# EAGLE design ArduinoPiano (EAGLE 7.3.0)
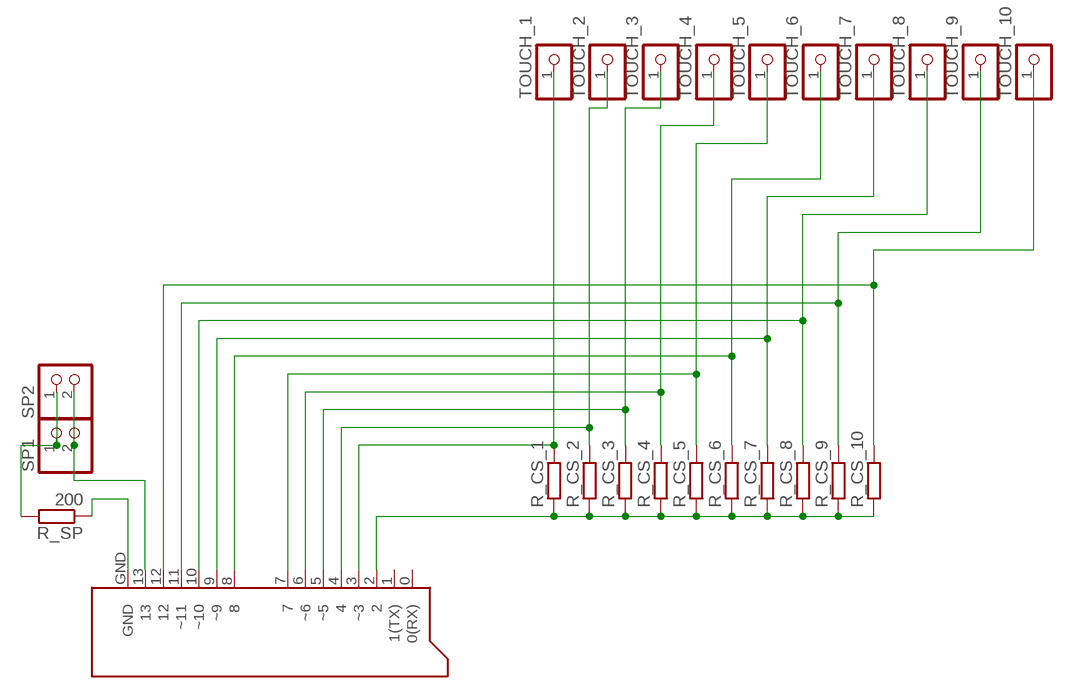
[diagram p0: schematic, sheet 1]

## Parts
PCB1  ARDUINO_UNO  [ARDUINO_UNO]
R_CS_1  R-EU_0204/7  [0204/7]
R_CS_2  R-EU_0204/7  [0204/7]
R_CS_3  R-EU_0204/7  [0204/7]
R_CS_4  R-EU_0204/7  [0204/7]
R_CS_5  R-EU_0204/7  [0204/7]
R_CS_6  R-EU_0204/7  [0204/7]
R_CS_7  R-EU_0204/7  [0204/7]
R_CS_8  R-EU_0204/7  [0204/7]
R_CS_9  R-EU_0204/7  [0204/7]
R_CS_10  R-EU_0204/7  [0204/7]
R_SP  200  R-EU_0204/7  [0204/7]
SP1  PINHD-1X2  [1X02]
SP2  PINHD-1X2  [1X02]
TOUCH_1  PINHD-1X1  [1X01]
TOUCH_2  PINHD-1X1  [1X01]
TOUCH_3  PINHD-1X1  [1X01]
TOUCH_4  PINHD-1X1  [1X01]
TOUCH_5  PINHD-1X1  [1X01]
TOUCH_6  PINHD-1X1  [1X01]
TOUCH_7  PINHD-1X1  [1X01]
TOUCH_8  PINHD-1X1  [1X01]
TOUCH_9  PINHD-1X1  [1X01]
TOUCH_10  PINHD-1X1  [1X01]

## Nets
+SPEAKER: PCB1.13 SP1.2 SP2.2
CS_REC_1: PCB1.3(~3) R_CS_1.2 TOUCH_1.1
CS_REC_2: PCB1.4 R_CS_2.2 TOUCH_2.1
CS_REC_3: PCB1.5(~5) R_CS_3.2 TOUCH_3.1
CS_REC_4: PCB1.6(~6) R_CS_4.2 TOUCH_4.1
CS_REC_5: PCB1.7 R_CS_5.2 TOUCH_5.1
CS_REC_6: PCB1.8 R_CS_6.2 TOUCH_6.1
CS_REC_7: PCB1.9(~9) R_CS_7.2 TOUCH_7.1
CS_REC_8: PCB1.10(~10) R_CS_8.2 TOUCH_8.1
CS_REC_9: PCB1.11(~11) R_CS_9.2 TOUCH_9.1
CS_REC_10: PCB1.12 R_CS_10.2 TOUCH_10.1
CS_SEND: PCB1.2 R_CS_1.1 R_CS_2.1 R_CS_3.1 R_CS_4.1 R_CS_5.1 R_CS_6.1 R_CS_7.1 R_CS_8.1 R_CS_9.1 R_CS_10.1
GND_SPEAKER: PCB1.GND R_SP.1
N$1: R_SP.2 SP1.1 SP2.1
Unconnected: PCB1.0(0(RX)) PCB1.1(1(TX))

## Library data of the parts
PCB1 = PianoArduino:ARDUINO_UNO: Device for representing an Arduino Uno board with a footprint in an EAGLE design. Created by Dave Young for Element14. More EAGLE documentation at: http://www.element14.com/community/community/knode/cadsoft_eagle
R_CS_1-R_CS_10 R_SP = resistor:R-EU_: RESISTOR, European symbol
SP1 SP2 = pinhead:PINHD-1X2: PIN HEADER
TOUCH_1-TOUCH_10 = pinhead:PINHD-1X1: PIN HEADER

## Board
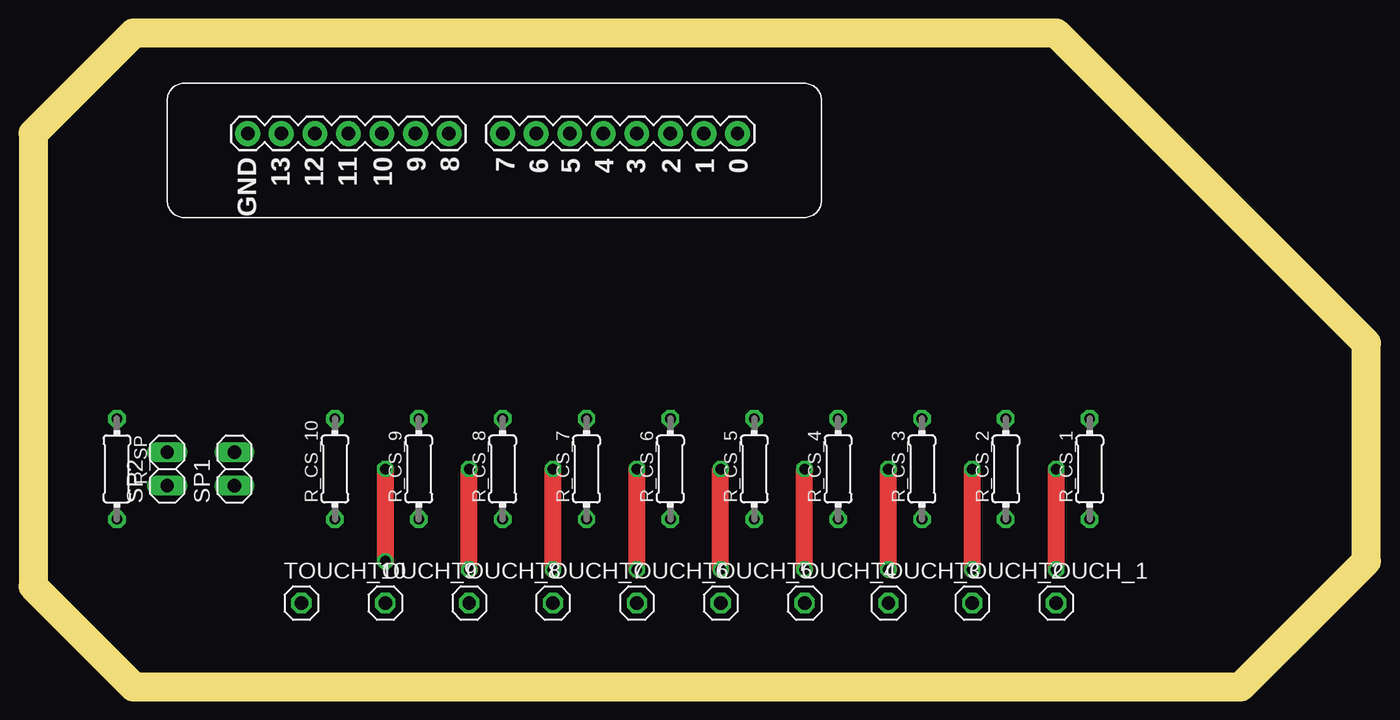
[diagram p1: board, top side]
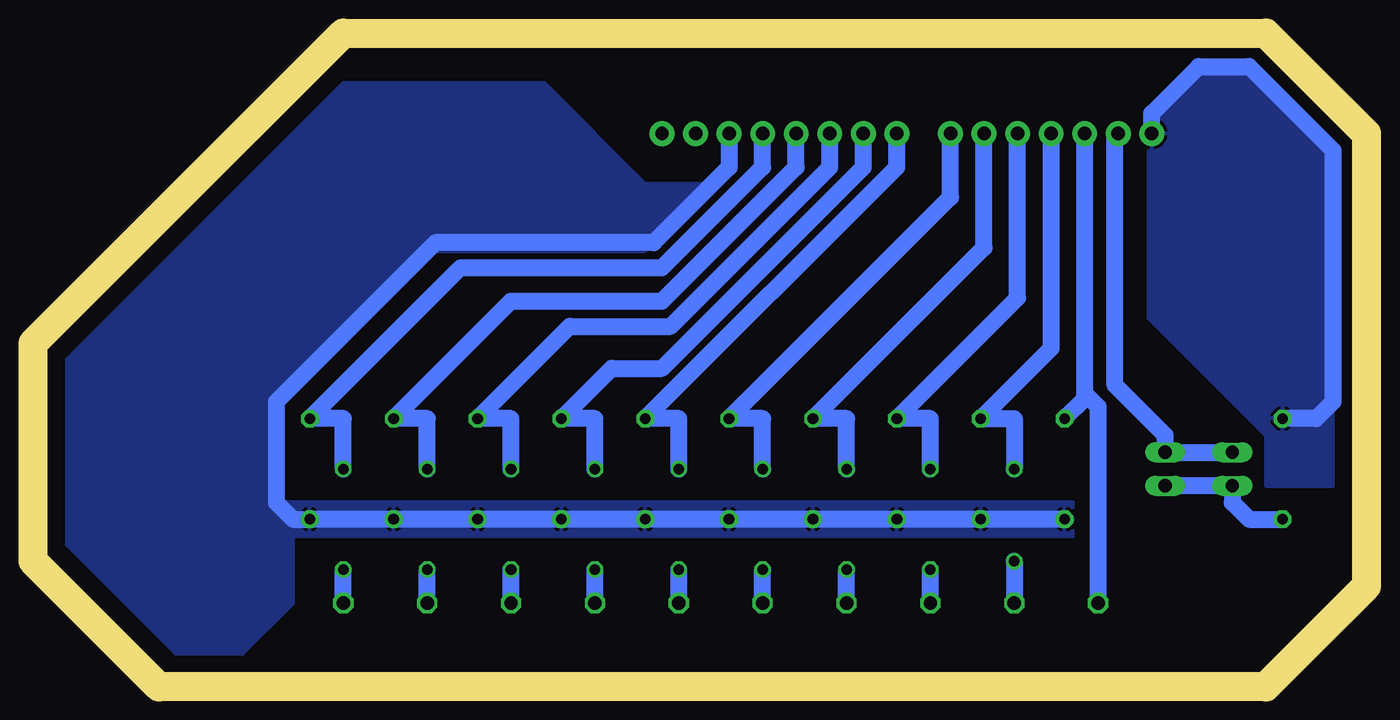
[diagram p2: board, bottom side, seen from below]

Size 100.97 x 49.53 mm. Coordinates in mm from the lower left corner, seen from the top.
Outline: 91.44,0 100.97,9.52 100.97,26.03 77.47,49.53 7.62,49.53 0,41.91 0,7.62 7.62,0 91.44,0
Copper layers (1*16): Top 0.035mm / dielectric 1.5mm / Bottom 0.035mm
Design rules "default": minimum track width 10mil, minimum drill 24mil, track to track 8mil, track to pad 8mil, pad to pad 8mil, via to via 8mil, smd to smd 8mil, copper to edge 40mil, drill to drill 8mil, minimum pad ring 10mil, minimum via ring 8mil, stop-mask expansion 4mil, vias tented up to drill 0mil, thermal gap 10mil
Milling: 8 lines

### Footprints (pad centres in the part's own frame; a part is rotated, then mirrored left to right if it is on the bottom)
ARDUINO_UNO = drill 1.016 pad 1.88: 0 43.18,6.35; 1 40.64,6.35; 2 38.1,6.35; 3 35.56,6.35; 4 33.02,6.35; 5 30.48,6.35; 6 27.94,6.35; 7 25.4,6.35; 8 21.336,6.35; 9 18.796,6.35; 10 16.256,6.35; 11 13.716,6.35; 12 11.176,6.35; 13 8.636,6.35; GND 6.096,6.35
0204/7 = drill 0.813 octagon: 1 -3.81,0; 2 3.81,0
1X02 = drill 1.016 long: 1 -1.27,0; 2 1.27,0
1X01 = drill 1.016 octagon: 1 0,0

### Placement (x,y rotation side)
PCB1  10.16,35.56 0 top
R_CS_1  80.01,16.51 90 top
R_CS_2  73.66,16.51 90 top
R_CS_3  67.31,16.51 90 top
R_CS_4  60.96,16.51 90 top
R_CS_5  54.61,16.51 90 top
R_CS_6  48.26,16.51 90 top
R_CS_7  41.91,16.51 90 top
R_CS_8  35.56,16.51 90 top
R_CS_9  29.21,16.51 90 top
R_CS_10  22.86,16.51 90 top
R_SP  6.35,16.51 270 top
SP1  15.24,16.51 90 top
SP2  10.16,16.51 90 top
TOUCH_1  77.47,6.35 0 top
TOUCH_2  71.12,6.35 0 top
TOUCH_3  64.77,6.35 0 top
TOUCH_4  58.42,6.35 0 top
TOUCH_5  52.07,6.35 0 top
TOUCH_6  45.72,6.35 0 top
TOUCH_7  39.37,6.35 0 top
TOUCH_8  33.02,6.35 0 top
TOUCH_9  26.67,6.35 0 top
TOUCH_10  20.32,6.35 0 top

### Tracks (layer width: path | path; a pad name or v marks a point on that pad's centre or on a via)
+SPEAKER
  Bottom 1.27: SP2.2 SP1.2 15.24,19.05 19.05,22.86 19.05,41.66 PCB1.13
CS_REC_1  (via drill 0.8)
  Top 1.27: v77.47,8.89 v77.47,16.51
  Bottom 1.27: PCB1.3 45.72,39.37 53.34,31.75 68.58,31.75 R_CS_1.2 77.47,20.32 v77.47,16.51 | TOUCH_1.1 v77.47,8.89
CS_REC_2  (via drill 0.8)
  Top 1.27: v71.12,8.89 v71.12,16.51
  Bottom 1.27: PCB1.4 43.18,39.37 53.34,29.21 64.77,29.21 R_CS_2.2 71.12,20.32 v71.12,16.51 | TOUCH_2.1 v71.12,8.89
CS_REC_3  (via drill 0.8)
  Top 1.27: v64.77,8.89 v64.77,16.51
  Bottom 1.27: PCB1.5 40.64,39.37 52.7,27.3 60.33,27.3 R_CS_3.2 64.77,20.32 v64.77,16.51 | TOUCH_3.1 v64.77,8.89
CS_REC_4  (via drill 0.8)
  Top 1.27: v58.42,8.89 v58.42,16.51
  Bottom 1.27: PCB1.6 38.1,39.37 53.34,24.13 57.15,24.13 R_CS_4.2 58.42,20.32 v58.42,16.51 | TOUCH_4.1 v58.42,8.89
CS_REC_5  (via drill 0.8)
  Top 1.27: v52.07,8.89 v52.07,16.51
  Bottom 1.27: PCB1.7 35.56,39.37 R_CS_5.2 52.07,20.32 v52.07,16.51 | TOUCH_5.1 v52.07,8.89
CS_REC_6  (via drill 0.8)
  Top 1.27: v45.72,8.89 v45.72,16.51
  Bottom 1.27: PCB1.8 31.5,37.08 R_CS_6.2 45.72,20.32 v45.72,16.51 | TOUCH_6.1 v45.72,8.89
CS_REC_7  (via drill 0.8)
  Top 1.27: v39.37,8.89 v39.37,16.51
  Bottom 1.27: PCB1.9 28.96,33.27 R_CS_7.2 39.37,20.32 v39.37,16.51 | TOUCH_7.1 v39.37,8.89
CS_REC_8  (via drill 0.8)
  Top 1.27: v33.02,8.89 v33.02,16.51
  Bottom 1.27: PCB1.10 26.42,29.46 R_CS_8.2 33.02,20.32 v33.02,16.51 | TOUCH_8.1 v33.02,8.89
CS_REC_9  (via drill 0.8)
  Top 1.27: v26.67,16.51 v26.67,9.52
  Bottom 1.27: PCB1.11 23.88,25.65 R_CS_9.2 26.67,20.32 v26.67,16.51 | v26.67,9.52 TOUCH_9.1
CS_REC_10
  Bottom 1.27: R_CS_10.2 21.34,21.84 21.34,22.22 | 21.34,22.22 PCB1.12 | TOUCH_10.1 20.32,21.21 21.34,22.22
CS_SEND
  Bottom 1.27: R_CS_10.1 R_CS_9.1 R_CS_8.1 R_CS_7.1 R_CS_6.1 R_CS_5.1 R_CS_4.1 R_CS_3.1 R_CS_2.1 R_CS_1.1 81.28,12.7 82.55,13.97 82.55,21.59 70.48,33.66 53.97,33.66 48.26,39.37 PCB1.2
  pour Bottom: 49.53,38.1 54.61,38.1 62.23,45.72 77.47,45.72 98.43,24.77 98.43,10.79 90.17,2.54 85.09,2.54 81.28,6.35 81.28,11.43 22.22,11.43 22.22,13.97 82.55,13.97 82.55,21.59 71.12,33.02 54.61,33.02
GND_SPEAKER
  Bottom 1.27: PCB1.GND 16.26,43.43 12.7,46.99 8.89,46.99 2.54,40.64 2.54,21.59 3.81,20.32 R_SP.1
  pour Bottom: 2.54,15.24 2.54,40.64 8.89,46.99 12.7,46.99 16.51,43.18 16.51,27.94 7.62,19.05 7.62,15.24
N$1
  Bottom 1.27: SP1.1 SP2.1 10.16,13.97 8.89,12.7 R_SP.2